# Altium schematic sheet TopLevel.SchDoc
size B; SheetNumber: 1; SheetTotal: 5
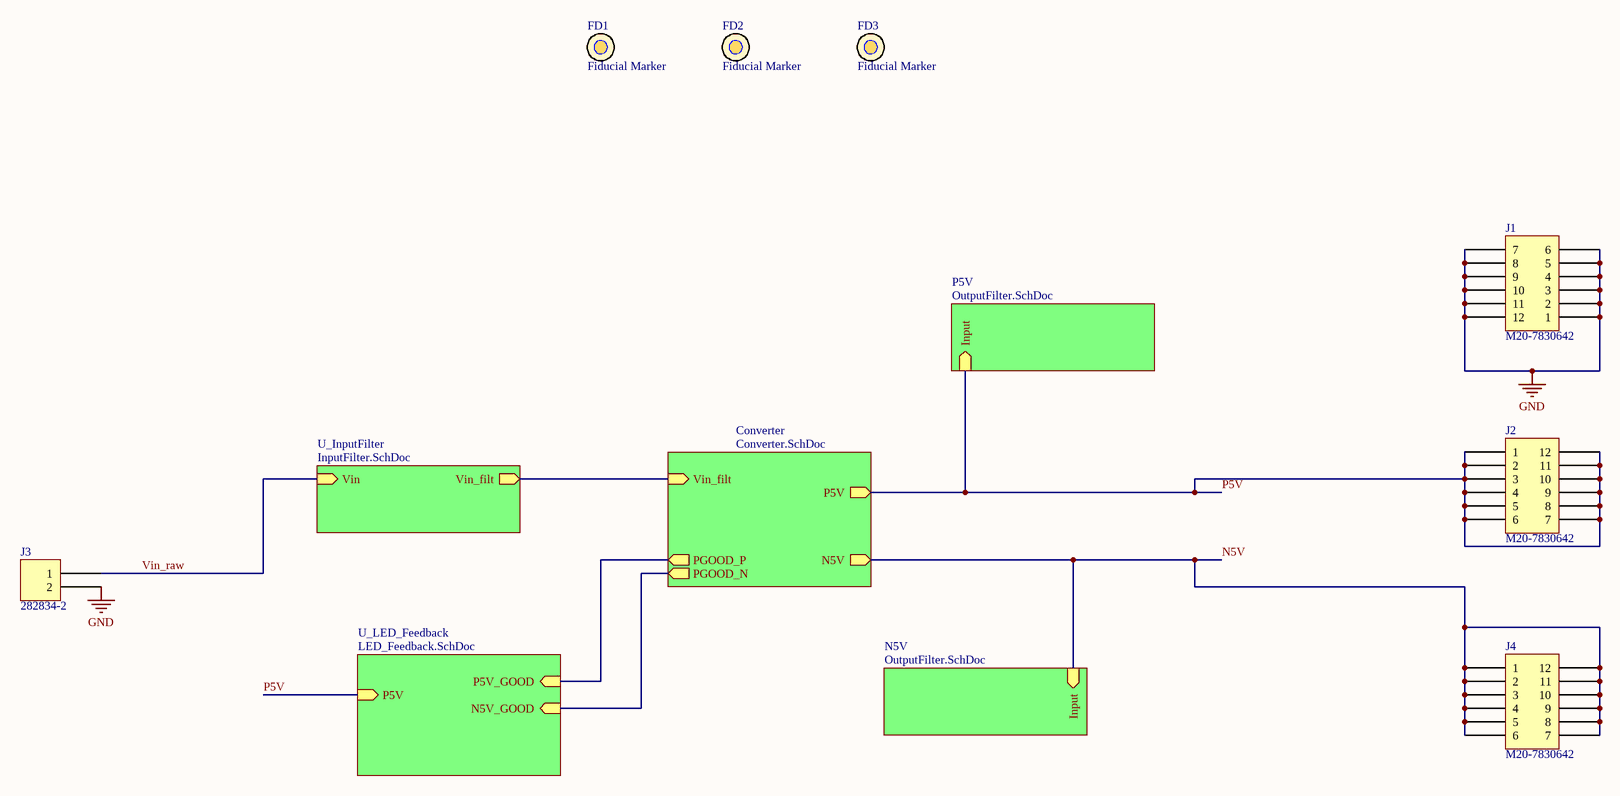
[diagram p0: TopLevel.SchDoc]

## Parts
FD1  Fiducial Marker  [FIDUCIAL]
FD2  Fiducial Marker  [FIDUCIAL]
FD3  Fiducial Marker  [FIDUCIAL]
J1  M20-7830642  [HARWIN M20-7830645]
J2  M20-7830642  [HARWIN M20-7830645]
J3  282834-2  [TE 282834-2]
J4  M20-7830642  [HARWIN M20-7830645]

## Sub-sheets
Converter = Converter.SchDoc: PGOOD_P (out), N5V (out), Vin_filt (in), P5V (out), PGOOD_N (out)
N5V = OutputFilter.SchDoc: Input (in)
P5V = OutputFilter.SchDoc: Input (in)
U_InputFilter = InputFilter.SchDoc: Vin (in), Vin_filt (out)
U_LED_Feedback = LED_Feedback.SchDoc: P5V (in), P5V_GOOD (in), N5V_GOOD (in)

## Nets
GND: J1.1 J1.2 J1.3 J1.4 J1.5 J1.6 J1.7 J1.8 J1.9 J1.10 J1.11 J1.12 J3.2
N5V: J4.1 J4.2 J4.3 J4.4 J4.5 J4.6 J4.7 J4.8 J4.9 J4.10 J4.11 J4.12 ; sheet Converter/N5V, sheet N5V/Input
P5V: J2.1 J2.2 J2.3 J2.4 J2.5 J2.6 J2.7 J2.8 J2.9 J2.10 J2.11 J2.12 ; sheet Converter/P5V, sheet P5V/Input, sheet U_LED_Feedback/P5V
Vin_raw: J3.1 ; sheet U_InputFilter/Vin
(unnamed): sheet Converter/PGOOD_P, sheet U_LED_Feedback/P5V_GOOD
(unnamed): sheet Converter/Vin_filt, sheet U_InputFilter/Vin_filt
(unnamed): sheet Converter/PGOOD_N, sheet U_LED_Feedback/N5V_GOOD

## Library data of the parts
FD1-FD3 = Fiducial
J1 J2 J4 = M20-7830642: CONN RCPT 12POS 0.1 GOLD PCB; Manufacturer: Harwin Inc.; Connector Type: Receptacle; Contact Length - Post: 0.118" (3.00mm); Current Rating (Amps): 3A; Mated Stacking Heights: 11.04mm, 12.63mm; Material Flammability Rating: UL94 V-0; Number of Positions: 12; Number of Positions Loaded: All; Pitch - Mating: 0.100" (2.54mm); Style: Board to Board or Cable; Part Number: M20-7830642; ComponentLink1Description: Datasheet; ComponentLink1URL: https://cdn.harwin.com/pdfs/C001XX_M20_Series_Connectors.pdf; ComponentLink2Description: DigiKey Link; ComponentLink2URL: https://www.digikey.com/en/products/detail/harwin-inc/M20-7830642/3727774; Contact Finish - Mating: Gold; Contact Finish - Post: Tin; Contact Finish Thickness - Mating: Flash; Contact Type: Female Socket; Fastening Type: Push-Pull; Insulation Color: Black; Insulation Height: 0.335" (8.51mm); LastUpdated: 9/21/2022 7:05:46 PM; Lifecycle Status: Active; Minimum Order: 1; Mounting Type: Through Hole; Number of Rows: 2; Operating Temperature: -40°C ~ 105°C; Packaging: Tube; Part Status: Active; Price: 0.96; Row Spacing - Mating: 0.100" (2.54mm); Series: M20; Supplier 1: DigiKey; Supplier Part Number 1: 952-1805-ND; Termination: Solder
J3 = 282834-2: TERM BLK 2P SIDE ENT 2.54MM PCB; Manufacturer: TE Connectivity AMP Connectors; Current: 10A; Mating Orientation: Horizontal with Board; Number of Levels: 1; Pitch: 0.100" (2.54mm); Positions Per Level: 2; Voltage: 150V; Wire Gauge: 16-30 AWG; Wire Termination: Screw - Rising Cage Clamp; Part Number: 282834-2; Color: Green; ComponentLink1Description: Datasheet; ComponentLink1URL: https://www.te.com/commerce/DocumentDelivery/DDEController?Action=srchrtrv&DocNm=282834&DocType=Customer+Drawing&DocLang=English; ComponentLink2Description: DigiKey Link; ComponentLink2URL: http://digikey.com/product-detail/en/te-connectivity-amp-connectors/282834-2/A98333-ND/1150135; LastUpdated: 1/15/2020 4:15:38 AM; Lifecycle Status: Active; Minimum Order: 1; Mounting Type: Through Hole; Packaging: Bulk; Part Status: Active; Price: 0.88; Series: Buchanan; Supplier 1: DigiKey; Supplier Part Number 1: A98333-ND